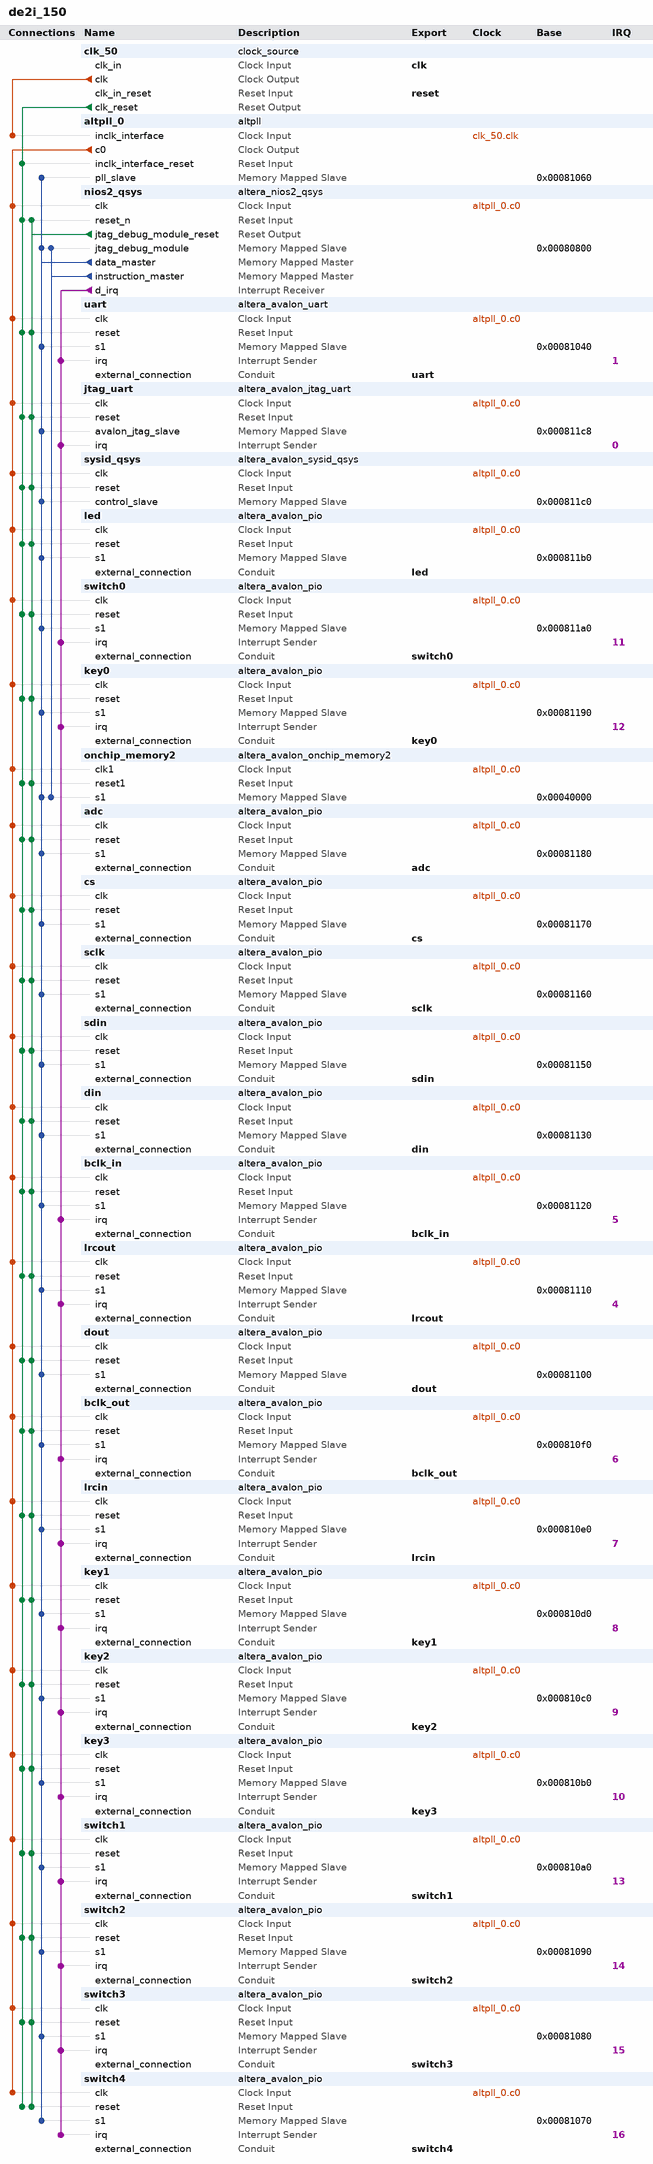
[diagram p0: system contents]
# Platform Designer (Qsys) system de2i_150, Cyclone IV GX EP4CGX150DF31C7
# Parameters at their usual value, and those the tool derives, are not listed.
package require -exact qsys 13.0.1.99.2
create_system de2i_150
set_project_property DEVICE_FAMILY {Cyclone IV GX}
set_project_property DEVICE EP4CGX150DF31C7

add_instance clk_50 clock_source 13.0
set_instance_parameter_value clk_50 clockFrequency 50000000

add_instance altpll_0 altpll 13.0
set_instance_parameter_value altpll_0 INCLK0_INPUT_FREQUENCY 20000
set_instance_parameter_value altpll_0 CLK0_MULTIPLY_BY 12
set_instance_parameter_value altpll_0 CLK0_DIVIDE_BY 5
set_instance_parameter_value altpll_0 PORT_clk1 PORT_UNUSED
set_instance_parameter_value altpll_0 PORT_clk2 PORT_UNUSED
set_instance_parameter_value altpll_0 PORT_clk3 PORT_UNUSED
set_instance_parameter_value altpll_0 PORT_ARESET PORT_UNUSED
set_instance_parameter_value altpll_0 PORT_LOCKED PORT_UNUSED

add_instance nios2_qsys altera_nios2_qsys 13.0
set_instance_parameter_value nios2_qsys resetSlave onchip_memory2.s1
set_instance_parameter_value nios2_qsys mmu_TLBMissExcSlave None
set_instance_parameter_value nios2_qsys exceptionSlave onchip_memory2.s1
set_instance_parameter_value nios2_qsys breakSlave nios2_qsys.jtag_debug_module
set_instance_parameter_value nios2_qsys impl Fast
set_instance_parameter_value nios2_qsys icache_size 4096

add_instance uart altera_avalon_uart 13.0.1.99.2
set_instance_parameter_value uart baud 115200
set_instance_parameter_value uart dataBits 8
set_instance_parameter_value uart fixedBaud true
set_instance_parameter_value uart parity NONE
set_instance_parameter_value uart stopBits 1

add_instance jtag_uart altera_avalon_jtag_uart 13.0.1.99.2
set_instance_parameter_value jtag_uart simInteractiveOptions NO_INTERACTIVE_WINDOWS

add_instance sysid_qsys altera_avalon_sysid_qsys 13.0
set_instance_parameter_value sysid_qsys id 0

add_instance led altera_avalon_pio 13.0.1.99.2
set_instance_parameter_value led direction Output
set_instance_parameter_value led width 8

add_instance switch0 altera_avalon_pio 13.0.1.99.2
set_instance_parameter_value switch0 captureEdge true
set_instance_parameter_value switch0 direction Input
set_instance_parameter_value switch0 edgeType ANY
set_instance_parameter_value switch0 generateIRQ true
set_instance_parameter_value switch0 irqType EDGE
set_instance_parameter_value switch0 width 1

add_instance key0 altera_avalon_pio 13.0.1.99.2
set_instance_parameter_value key0 captureEdge true
set_instance_parameter_value key0 direction Input
set_instance_parameter_value key0 generateIRQ true
set_instance_parameter_value key0 irqType EDGE
set_instance_parameter_value key0 width 1

add_instance onchip_memory2 altera_avalon_onchip_memory2 13.0.1.99.2
set_instance_parameter_value onchip_memory2 dataWidth 32
set_instance_parameter_value onchip_memory2 dualPort false
set_instance_parameter_value onchip_memory2 initMemContent true
set_instance_parameter_value onchip_memory2 initializationFileName onchip_mem.hex
set_instance_parameter_value onchip_memory2 memorySize 204800

add_instance adc altera_avalon_pio 13.0.1.99.2
set_instance_parameter_value adc direction Input
set_instance_parameter_value adc width 14

add_instance cs altera_avalon_pio 13.0.1.99.2
set_instance_parameter_value cs direction Output
set_instance_parameter_value cs width 1

add_instance sclk altera_avalon_pio 13.0.1.99.2
set_instance_parameter_value sclk direction Output
set_instance_parameter_value sclk width 1

add_instance sdin altera_avalon_pio 13.0.1.99.2
set_instance_parameter_value sdin direction Output
set_instance_parameter_value sdin width 1

add_instance din altera_avalon_pio 13.0.1.99.2
set_instance_parameter_value din direction Output
set_instance_parameter_value din width 1

add_instance bclk_in altera_avalon_pio 13.0.1.99.2
set_instance_parameter_value bclk_in captureEdge true
set_instance_parameter_value bclk_in direction Input
set_instance_parameter_value bclk_in generateIRQ true
set_instance_parameter_value bclk_in irqType EDGE
set_instance_parameter_value bclk_in width 1

add_instance lrcout altera_avalon_pio 13.0.1.99.2
set_instance_parameter_value lrcout captureEdge true
set_instance_parameter_value lrcout direction Input
set_instance_parameter_value lrcout edgeType ANY
set_instance_parameter_value lrcout generateIRQ true
set_instance_parameter_value lrcout irqType EDGE
set_instance_parameter_value lrcout width 1

add_instance dout altera_avalon_pio 13.0.1.99.2
set_instance_parameter_value dout direction Input
set_instance_parameter_value dout width 1

add_instance bclk_out altera_avalon_pio 13.0.1.99.2
set_instance_parameter_value bclk_out captureEdge true
set_instance_parameter_value bclk_out direction Input
set_instance_parameter_value bclk_out generateIRQ true
set_instance_parameter_value bclk_out irqType EDGE
set_instance_parameter_value bclk_out width 1

add_instance lrcin altera_avalon_pio 13.0.1.99.2
set_instance_parameter_value lrcin captureEdge true
set_instance_parameter_value lrcin direction Input
set_instance_parameter_value lrcin edgeType ANY
set_instance_parameter_value lrcin generateIRQ true
set_instance_parameter_value lrcin irqType EDGE
set_instance_parameter_value lrcin width 1

add_instance key1 altera_avalon_pio 13.0.1.99.2
set_instance_parameter_value key1 captureEdge true
set_instance_parameter_value key1 direction Input
set_instance_parameter_value key1 generateIRQ true
set_instance_parameter_value key1 irqType EDGE
set_instance_parameter_value key1 width 1

add_instance key2 altera_avalon_pio 13.0.1.99.2
set_instance_parameter_value key2 captureEdge true
set_instance_parameter_value key2 direction Input
set_instance_parameter_value key2 generateIRQ true
set_instance_parameter_value key2 irqType EDGE
set_instance_parameter_value key2 width 1

add_instance key3 altera_avalon_pio 13.0.1.99.2
set_instance_parameter_value key3 captureEdge true
set_instance_parameter_value key3 direction Input
set_instance_parameter_value key3 generateIRQ true
set_instance_parameter_value key3 irqType EDGE
set_instance_parameter_value key3 width 1

add_instance switch1 altera_avalon_pio 13.0.1.99.2
set_instance_parameter_value switch1 captureEdge true
set_instance_parameter_value switch1 direction Input
set_instance_parameter_value switch1 edgeType ANY
set_instance_parameter_value switch1 generateIRQ true
set_instance_parameter_value switch1 irqType EDGE
set_instance_parameter_value switch1 width 1

add_instance switch2 altera_avalon_pio 13.0.1.99.2
set_instance_parameter_value switch2 captureEdge true
set_instance_parameter_value switch2 direction Input
set_instance_parameter_value switch2 edgeType ANY
set_instance_parameter_value switch2 generateIRQ true
set_instance_parameter_value switch2 irqType EDGE
set_instance_parameter_value switch2 width 1

add_instance switch3 altera_avalon_pio 13.0.1.99.2
set_instance_parameter_value switch3 captureEdge true
set_instance_parameter_value switch3 direction Input
set_instance_parameter_value switch3 edgeType ANY
set_instance_parameter_value switch3 generateIRQ true
set_instance_parameter_value switch3 irqType EDGE
set_instance_parameter_value switch3 width 1

add_instance switch4 altera_avalon_pio 13.0.1.99.2
set_instance_parameter_value switch4 captureEdge true
set_instance_parameter_value switch4 direction Input
set_instance_parameter_value switch4 edgeType ANY
set_instance_parameter_value switch4 generateIRQ true
set_instance_parameter_value switch4 irqType EDGE
set_instance_parameter_value switch4 width 1

# connections
add_connection altpll_0.c0 adc.clk clock
add_connection altpll_0.c0 bclk_in.clk clock
add_connection altpll_0.c0 bclk_out.clk clock
add_connection altpll_0.c0 cs.clk clock
add_connection altpll_0.c0 din.clk clock
add_connection altpll_0.c0 dout.clk clock
add_connection altpll_0.c0 jtag_uart.clk clock
add_connection altpll_0.c0 key0.clk clock
add_connection altpll_0.c0 key1.clk clock
add_connection altpll_0.c0 key2.clk clock
add_connection altpll_0.c0 key3.clk clock
add_connection altpll_0.c0 led.clk clock
add_connection altpll_0.c0 lrcin.clk clock
add_connection altpll_0.c0 lrcout.clk clock
add_connection altpll_0.c0 nios2_qsys.clk clock
add_connection altpll_0.c0 onchip_memory2.clk1 clock
add_connection altpll_0.c0 sclk.clk clock
add_connection altpll_0.c0 sdin.clk clock
add_connection altpll_0.c0 switch0.clk clock
add_connection altpll_0.c0 switch1.clk clock
add_connection altpll_0.c0 switch2.clk clock
add_connection altpll_0.c0 switch3.clk clock
add_connection altpll_0.c0 switch4.clk clock
add_connection altpll_0.c0 sysid_qsys.clk clock
add_connection altpll_0.c0 uart.clk clock
add_connection clk_50.clk altpll_0.inclk_interface clock
add_connection clk_50.clk_reset adc.reset reset
add_connection clk_50.clk_reset altpll_0.inclk_interface_reset reset
add_connection clk_50.clk_reset bclk_in.reset reset
add_connection clk_50.clk_reset bclk_out.reset reset
add_connection clk_50.clk_reset cs.reset reset
add_connection clk_50.clk_reset din.reset reset
add_connection clk_50.clk_reset dout.reset reset
add_connection clk_50.clk_reset jtag_uart.reset reset
add_connection clk_50.clk_reset key0.reset reset
add_connection clk_50.clk_reset key1.reset reset
add_connection clk_50.clk_reset key2.reset reset
add_connection clk_50.clk_reset key3.reset reset
add_connection clk_50.clk_reset led.reset reset
add_connection clk_50.clk_reset lrcin.reset reset
add_connection clk_50.clk_reset lrcout.reset reset
add_connection clk_50.clk_reset nios2_qsys.reset_n reset
add_connection clk_50.clk_reset onchip_memory2.reset1 reset
add_connection clk_50.clk_reset sclk.reset reset
add_connection clk_50.clk_reset sdin.reset reset
add_connection clk_50.clk_reset switch0.reset reset
add_connection clk_50.clk_reset switch1.reset reset
add_connection clk_50.clk_reset switch2.reset reset
add_connection clk_50.clk_reset switch3.reset reset
add_connection clk_50.clk_reset switch4.reset reset
add_connection clk_50.clk_reset sysid_qsys.reset reset
add_connection clk_50.clk_reset uart.reset reset
add_connection nios2_qsys.jtag_debug_module_reset adc.reset reset
add_connection nios2_qsys.jtag_debug_module_reset bclk_in.reset reset
add_connection nios2_qsys.jtag_debug_module_reset bclk_out.reset reset
add_connection nios2_qsys.jtag_debug_module_reset cs.reset reset
add_connection nios2_qsys.jtag_debug_module_reset din.reset reset
add_connection nios2_qsys.jtag_debug_module_reset dout.reset reset
add_connection nios2_qsys.jtag_debug_module_reset jtag_uart.reset reset
add_connection nios2_qsys.jtag_debug_module_reset key0.reset reset
add_connection nios2_qsys.jtag_debug_module_reset key1.reset reset
add_connection nios2_qsys.jtag_debug_module_reset key2.reset reset
add_connection nios2_qsys.jtag_debug_module_reset key3.reset reset
add_connection nios2_qsys.jtag_debug_module_reset led.reset reset
add_connection nios2_qsys.jtag_debug_module_reset lrcin.reset reset
add_connection nios2_qsys.jtag_debug_module_reset lrcout.reset reset
add_connection nios2_qsys.jtag_debug_module_reset nios2_qsys.reset_n reset
add_connection nios2_qsys.jtag_debug_module_reset onchip_memory2.reset1 reset
add_connection nios2_qsys.jtag_debug_module_reset sclk.reset reset
add_connection nios2_qsys.jtag_debug_module_reset sdin.reset reset
add_connection nios2_qsys.jtag_debug_module_reset switch0.reset reset
add_connection nios2_qsys.jtag_debug_module_reset switch1.reset reset
add_connection nios2_qsys.jtag_debug_module_reset switch2.reset reset
add_connection nios2_qsys.jtag_debug_module_reset switch3.reset reset
add_connection nios2_qsys.jtag_debug_module_reset switch4.reset reset
add_connection nios2_qsys.jtag_debug_module_reset sysid_qsys.reset reset
add_connection nios2_qsys.jtag_debug_module_reset uart.reset reset
add_connection nios2_qsys.data_master adc.s1 avalon
set_connection_parameter_value nios2_qsys.data_master/adc.s1 baseAddress 0x00081180
add_connection nios2_qsys.data_master altpll_0.pll_slave avalon
set_connection_parameter_value nios2_qsys.data_master/altpll_0.pll_slave baseAddress 0x00081060
add_connection nios2_qsys.data_master bclk_in.s1 avalon
set_connection_parameter_value nios2_qsys.data_master/bclk_in.s1 baseAddress 0x00081120
add_connection nios2_qsys.data_master bclk_out.s1 avalon
set_connection_parameter_value nios2_qsys.data_master/bclk_out.s1 baseAddress 0x000810f0
add_connection nios2_qsys.data_master cs.s1 avalon
set_connection_parameter_value nios2_qsys.data_master/cs.s1 baseAddress 0x00081170
add_connection nios2_qsys.data_master din.s1 avalon
set_connection_parameter_value nios2_qsys.data_master/din.s1 baseAddress 0x00081130
add_connection nios2_qsys.data_master dout.s1 avalon
set_connection_parameter_value nios2_qsys.data_master/dout.s1 baseAddress 0x00081100
add_connection nios2_qsys.data_master jtag_uart.avalon_jtag_slave avalon
set_connection_parameter_value nios2_qsys.data_master/jtag_uart.avalon_jtag_slave baseAddress 0x000811c8
add_connection nios2_qsys.data_master key0.s1 avalon
set_connection_parameter_value nios2_qsys.data_master/key0.s1 baseAddress 0x00081190
add_connection nios2_qsys.data_master key1.s1 avalon
set_connection_parameter_value nios2_qsys.data_master/key1.s1 baseAddress 0x000810d0
add_connection nios2_qsys.data_master key2.s1 avalon
set_connection_parameter_value nios2_qsys.data_master/key2.s1 baseAddress 0x000810c0
add_connection nios2_qsys.data_master key3.s1 avalon
set_connection_parameter_value nios2_qsys.data_master/key3.s1 baseAddress 0x000810b0
add_connection nios2_qsys.data_master led.s1 avalon
set_connection_parameter_value nios2_qsys.data_master/led.s1 baseAddress 0x000811b0
add_connection nios2_qsys.data_master lrcin.s1 avalon
set_connection_parameter_value nios2_qsys.data_master/lrcin.s1 baseAddress 0x000810e0
add_connection nios2_qsys.data_master lrcout.s1 avalon
set_connection_parameter_value nios2_qsys.data_master/lrcout.s1 baseAddress 0x00081110
add_connection nios2_qsys.data_master nios2_qsys.jtag_debug_module avalon
set_connection_parameter_value nios2_qsys.data_master/nios2_qsys.jtag_debug_module baseAddress 0x00080800
add_connection nios2_qsys.data_master onchip_memory2.s1 avalon
set_connection_parameter_value nios2_qsys.data_master/onchip_memory2.s1 baseAddress 0x00040000
add_connection nios2_qsys.data_master sclk.s1 avalon
set_connection_parameter_value nios2_qsys.data_master/sclk.s1 baseAddress 0x00081160
add_connection nios2_qsys.data_master sdin.s1 avalon
set_connection_parameter_value nios2_qsys.data_master/sdin.s1 baseAddress 0x00081150
add_connection nios2_qsys.data_master switch0.s1 avalon
set_connection_parameter_value nios2_qsys.data_master/switch0.s1 baseAddress 0x000811a0
add_connection nios2_qsys.data_master switch1.s1 avalon
set_connection_parameter_value nios2_qsys.data_master/switch1.s1 baseAddress 0x000810a0
add_connection nios2_qsys.data_master switch2.s1 avalon
set_connection_parameter_value nios2_qsys.data_master/switch2.s1 baseAddress 0x00081090
add_connection nios2_qsys.data_master switch3.s1 avalon
set_connection_parameter_value nios2_qsys.data_master/switch3.s1 baseAddress 0x00081080
add_connection nios2_qsys.data_master switch4.s1 avalon
set_connection_parameter_value nios2_qsys.data_master/switch4.s1 baseAddress 0x00081070
add_connection nios2_qsys.data_master sysid_qsys.control_slave avalon
set_connection_parameter_value nios2_qsys.data_master/sysid_qsys.control_slave baseAddress 0x000811c0
add_connection nios2_qsys.data_master uart.s1 avalon
set_connection_parameter_value nios2_qsys.data_master/uart.s1 baseAddress 0x00081040
add_connection nios2_qsys.instruction_master nios2_qsys.jtag_debug_module avalon
set_connection_parameter_value nios2_qsys.instruction_master/nios2_qsys.jtag_debug_module baseAddress 0x00080800
add_connection nios2_qsys.instruction_master onchip_memory2.s1 avalon
set_connection_parameter_value nios2_qsys.instruction_master/onchip_memory2.s1 baseAddress 0x00040000
add_connection nios2_qsys.d_irq bclk_in.irq interrupt
set_connection_parameter_value nios2_qsys.d_irq/bclk_in.irq irqNumber 5
add_connection nios2_qsys.d_irq bclk_out.irq interrupt
set_connection_parameter_value nios2_qsys.d_irq/bclk_out.irq irqNumber 6
add_connection nios2_qsys.d_irq jtag_uart.irq interrupt
set_connection_parameter_value nios2_qsys.d_irq/jtag_uart.irq irqNumber 0
add_connection nios2_qsys.d_irq key0.irq interrupt
set_connection_parameter_value nios2_qsys.d_irq/key0.irq irqNumber 12
add_connection nios2_qsys.d_irq key1.irq interrupt
set_connection_parameter_value nios2_qsys.d_irq/key1.irq irqNumber 8
add_connection nios2_qsys.d_irq key2.irq interrupt
set_connection_parameter_value nios2_qsys.d_irq/key2.irq irqNumber 9
add_connection nios2_qsys.d_irq key3.irq interrupt
set_connection_parameter_value nios2_qsys.d_irq/key3.irq irqNumber 10
add_connection nios2_qsys.d_irq lrcin.irq interrupt
set_connection_parameter_value nios2_qsys.d_irq/lrcin.irq irqNumber 7
add_connection nios2_qsys.d_irq lrcout.irq interrupt
set_connection_parameter_value nios2_qsys.d_irq/lrcout.irq irqNumber 4
add_connection nios2_qsys.d_irq switch0.irq interrupt
set_connection_parameter_value nios2_qsys.d_irq/switch0.irq irqNumber 11
add_connection nios2_qsys.d_irq switch1.irq interrupt
set_connection_parameter_value nios2_qsys.d_irq/switch1.irq irqNumber 13
add_connection nios2_qsys.d_irq switch2.irq interrupt
set_connection_parameter_value nios2_qsys.d_irq/switch2.irq irqNumber 14
add_connection nios2_qsys.d_irq switch3.irq interrupt
set_connection_parameter_value nios2_qsys.d_irq/switch3.irq irqNumber 15
add_connection nios2_qsys.d_irq switch4.irq interrupt
set_connection_parameter_value nios2_qsys.d_irq/switch4.irq irqNumber 16
add_connection nios2_qsys.d_irq uart.irq interrupt
set_connection_parameter_value nios2_qsys.d_irq/uart.irq irqNumber 1

# exported interfaces
add_interface clk clock sink
set_interface_property clk EXPORT_OF clk_50.clk_in
add_interface reset reset sink
set_interface_property reset EXPORT_OF clk_50.clk_in_reset
add_interface switch0 conduit end
set_interface_property switch0 EXPORT_OF switch0.external_connection
add_interface led conduit end
set_interface_property led EXPORT_OF led.external_connection
add_interface key0 conduit end
set_interface_property key0 EXPORT_OF key0.external_connection
add_interface uart conduit end
set_interface_property uart EXPORT_OF uart.external_connection
add_interface adc conduit end
set_interface_property adc EXPORT_OF adc.external_connection
add_interface cs conduit end
set_interface_property cs EXPORT_OF cs.external_connection
add_interface sclk conduit end
set_interface_property sclk EXPORT_OF sclk.external_connection
add_interface sdin conduit end
set_interface_property sdin EXPORT_OF sdin.external_connection
add_interface din conduit end
set_interface_property din EXPORT_OF din.external_connection
add_interface bclk_in conduit end
set_interface_property bclk_in EXPORT_OF bclk_in.external_connection
add_interface lrcout conduit end
set_interface_property lrcout EXPORT_OF lrcout.external_connection
add_interface dout conduit end
set_interface_property dout EXPORT_OF dout.external_connection
add_interface bclk_out conduit end
set_interface_property bclk_out EXPORT_OF bclk_out.external_connection
add_interface lrcin conduit end
set_interface_property lrcin EXPORT_OF lrcin.external_connection
add_interface key1 conduit end
set_interface_property key1 EXPORT_OF key1.external_connection
add_interface key2 conduit end
set_interface_property key2 EXPORT_OF key2.external_connection
add_interface key3 conduit end
set_interface_property key3 EXPORT_OF key3.external_connection
add_interface switch1 conduit end
set_interface_property switch1 EXPORT_OF switch1.external_connection
add_interface switch2 conduit end
set_interface_property switch2 EXPORT_OF switch2.external_connection
add_interface switch3 conduit end
set_interface_property switch3 EXPORT_OF switch3.external_connection
add_interface switch4 conduit end
set_interface_property switch4 EXPORT_OF switch4.external_connection

set_interconnect_requirement {$system} qsys_mm.clockCrossingAdapter HANDSHAKE
set_interconnect_requirement {$system} qsys_mm.maxAdditionalLatency 1

save_system de2i_150.qsys
